# Altium schematic sheet Con_Mic_Module(no gain).SchDoc
size A4
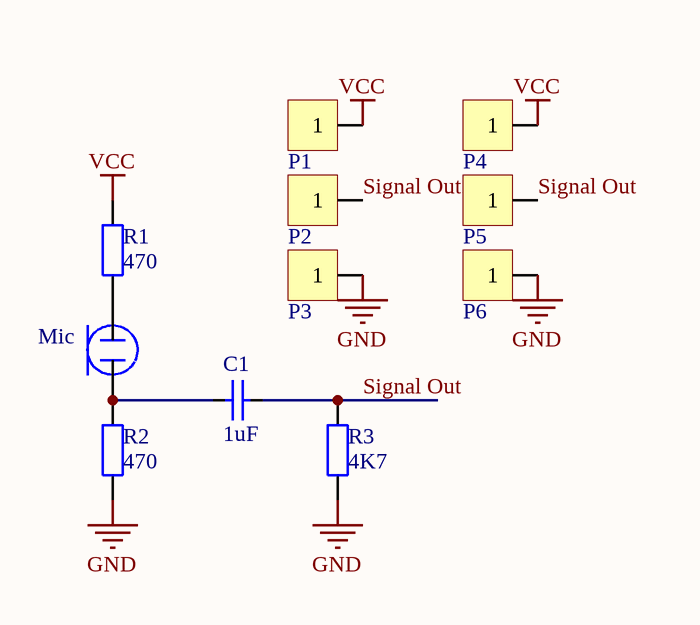
[diagram p0: Con_Mic_Module(no gain).SchDoc]

## Parts
C1  value 1uF  [CAP_0805]  (hidden comment: Cap_0805)
Mic  Mic  [Con_Mic_9.6mm]
P1  Pad1X1_1.27  [Pad1X1_1.27]  (value not drawn)
P2  Pad1X1_1.27  [Pad1X1_1.27]  (value not drawn)
P3  Pad1X1_1.27  [Pad1X1_1.27]  (value not drawn)
P4  HDR1X1_180_2.54  [HDR1X1_180_2.54]  (value not drawn)
P5  HDR1X1_180_2.54  [HDR1X1_180_2.54]  (value not drawn)
P6  HDR1X1_180_2.54  [HDR1X1_180_2.54]  (value not drawn)
R1  value 470  [RES_0805]  (hidden comment: Res_0805)
R2  value 470  [RES_0805]  (hidden comment: Res_0805)
R3  value 4K7  [RES_0805]  (hidden comment: Res_0805)

## Nets
GND: P3.1 P6.1 R2.1 R3.1
VCC: P1.1 P4.1 R1.2
Signal Out: C1.2 P2.1 P5.1 R3.2
NetC1_1: C1.1 Mic.2(RigidPlat) R2.2
NetMic_1: Mic.1(FlexiblePlat) R1.1

## Library data of the parts
C1 = Cap_0805: Capacitor
Mic = Con_Mic_9.7mm: Condenser Microphone
P1-P3 = Pad1X1_1.27: Header
P4-P6 = HDR1X1_180_2.54: Header
R1-R3 = Res_0805: Resistor